# Vivado block design FullAdder32, xc7a35ticpg236-1L, Vivado 2019.1
create_bd_design FullAdder32

create_bd_cell -type ip -vlnv xilinx.com:user:FullAdder1:1.0 FullAdder1_0
create_bd_cell -type ip -vlnv xilinx.com:user:FullAdder1:1.0 FullAdder1_1
create_bd_cell -type ip -vlnv xilinx.com:user:FullAdder1:1.0 FullAdder1_2
create_bd_cell -type ip -vlnv xilinx.com:user:FullAdder1:1.0 FullAdder1_3
create_bd_cell -type ip -vlnv xilinx.com:user:FullAdder1:1.0 FullAdder1_4
create_bd_cell -type ip -vlnv xilinx.com:user:FullAdder1:1.0 FullAdder1_5
create_bd_cell -type ip -vlnv xilinx.com:user:FullAdder1:1.0 FullAdder1_6
create_bd_cell -type ip -vlnv xilinx.com:user:FullAdder1:1.0 FullAdder1_7
create_bd_cell -type ip -vlnv xilinx.com:user:FullAdder1:1.0 FullAdder1_8
create_bd_cell -type ip -vlnv xilinx.com:user:FullAdder1:1.0 FullAdder1_9
create_bd_cell -type ip -vlnv xilinx.com:user:FullAdder1:1.0 FullAdder1_10
create_bd_cell -type ip -vlnv xilinx.com:user:FullAdder1:1.0 FullAdder1_11
create_bd_cell -type ip -vlnv xilinx.com:user:FullAdder1:1.0 FullAdder1_12
create_bd_cell -type ip -vlnv xilinx.com:user:FullAdder1:1.0 FullAdder1_13
create_bd_cell -type ip -vlnv xilinx.com:user:FullAdder1:1.0 FullAdder1_14
create_bd_cell -type ip -vlnv xilinx.com:user:FullAdder1:1.0 FullAdder1_15
create_bd_cell -type ip -vlnv xilinx.com:user:FullAdder1:1.0 FullAdder1_16
create_bd_cell -type ip -vlnv xilinx.com:user:FullAdder1:1.0 FullAdder1_17
create_bd_cell -type ip -vlnv xilinx.com:user:FullAdder1:1.0 FullAdder1_18
create_bd_cell -type ip -vlnv xilinx.com:user:FullAdder1:1.0 FullAdder1_19
create_bd_cell -type ip -vlnv xilinx.com:user:FullAdder1:1.0 FullAdder1_20
create_bd_cell -type ip -vlnv xilinx.com:user:FullAdder1:1.0 FullAdder1_21
create_bd_cell -type ip -vlnv xilinx.com:user:FullAdder1:1.0 FullAdder1_22
create_bd_cell -type ip -vlnv xilinx.com:user:FullAdder1:1.0 FullAdder1_23
create_bd_cell -type ip -vlnv xilinx.com:user:FullAdder1:1.0 FullAdder1_24
create_bd_cell -type ip -vlnv xilinx.com:user:FullAdder1:1.0 FullAdder1_25
create_bd_cell -type ip -vlnv xilinx.com:user:FullAdder1:1.0 FullAdder1_26
create_bd_cell -type ip -vlnv xilinx.com:user:FullAdder1:1.0 FullAdder1_27
create_bd_cell -type ip -vlnv xilinx.com:user:FullAdder1:1.0 FullAdder1_28
create_bd_cell -type ip -vlnv xilinx.com:user:FullAdder1:1.0 FullAdder1_29
create_bd_cell -type ip -vlnv xilinx.com:user:FullAdder1:1.0 FullAdder1_30
create_bd_cell -type ip -vlnv xilinx.com:user:FullAdder1:1.0 FullAdder1_31

# ---- connections ----

connect_bd_net [get_bd_pins FullAdder1_0/CO] [get_bd_pins FullAdder1_1/CI]
connect_bd_net [get_bd_pins FullAdder1_1/CO] [get_bd_pins FullAdder1_2/CI]
connect_bd_net [get_bd_pins FullAdder1_2/CO] [get_bd_pins FullAdder1_3/CI]
connect_bd_net [get_bd_pins FullAdder1_3/CO] [get_bd_pins FullAdder1_4/CI]
connect_bd_net [get_bd_pins FullAdder1_4/CO] [get_bd_pins FullAdder1_5/CI]
connect_bd_net [get_bd_pins FullAdder1_5/CO] [get_bd_pins FullAdder1_6/CI]
connect_bd_net [get_bd_pins FullAdder1_6/CO] [get_bd_pins FullAdder1_7/CI]
connect_bd_net [get_bd_pins FullAdder1_7/CO] [get_bd_pins FullAdder1_8/CI]
connect_bd_net [get_bd_pins FullAdder1_8/CO] [get_bd_pins FullAdder1_9/CI]
connect_bd_net [get_bd_pins FullAdder1_9/CO] [get_bd_pins FullAdder1_10/CI]
connect_bd_net [get_bd_pins FullAdder1_10/CO] [get_bd_pins FullAdder1_11/CI]
connect_bd_net [get_bd_pins FullAdder1_11/CO] [get_bd_pins FullAdder1_12/CI]
connect_bd_net [get_bd_pins FullAdder1_12/CO] [get_bd_pins FullAdder1_13/CI]
connect_bd_net [get_bd_pins FullAdder1_13/CO] [get_bd_pins FullAdder1_14/CI]
connect_bd_net [get_bd_pins FullAdder1_14/CO] [get_bd_pins FullAdder1_15/CI]
connect_bd_net [get_bd_pins FullAdder1_15/CO] [get_bd_pins FullAdder1_16/CI]
connect_bd_net [get_bd_pins FullAdder1_16/CO] [get_bd_pins FullAdder1_17/CI]
connect_bd_net [get_bd_pins FullAdder1_17/CO] [get_bd_pins FullAdder1_18/CI]
connect_bd_net [get_bd_pins FullAdder1_18/CO] [get_bd_pins FullAdder1_19/CI]
connect_bd_net [get_bd_pins FullAdder1_19/CO] [get_bd_pins FullAdder1_20/CI]
connect_bd_net [get_bd_pins FullAdder1_20/CO] [get_bd_pins FullAdder1_21/CI]
connect_bd_net [get_bd_pins FullAdder1_21/CO] [get_bd_pins FullAdder1_22/CI]
connect_bd_net [get_bd_pins FullAdder1_22/CO] [get_bd_pins FullAdder1_23/CI]
connect_bd_net [get_bd_pins FullAdder1_23/CO] [get_bd_pins FullAdder1_24/CI]
connect_bd_net [get_bd_pins FullAdder1_24/CO] [get_bd_pins FullAdder1_25/CI]
connect_bd_net [get_bd_pins FullAdder1_25/CO] [get_bd_pins FullAdder1_26/CI]
connect_bd_net [get_bd_pins FullAdder1_26/CO] [get_bd_pins FullAdder1_27/CI]
connect_bd_net [get_bd_pins FullAdder1_27/CO] [get_bd_pins FullAdder1_28/CI]
connect_bd_net [get_bd_pins FullAdder1_28/CO] [get_bd_pins FullAdder1_29/CI]
connect_bd_net [get_bd_pins FullAdder1_29/CO] [get_bd_pins FullAdder1_30/CI]
connect_bd_net [get_bd_pins FullAdder1_30/CO] [get_bd_pins FullAdder1_31/CI]
connect_bd_net -net A_1 [get_bd_pins FullAdder1_0/A] [get_bd_pins FullAdder1_1/A]

validate_bd_design
save_bd_design
